# Altium schematic sheet Bluetooth.SchDoc
size A4; SheetNumber: 3
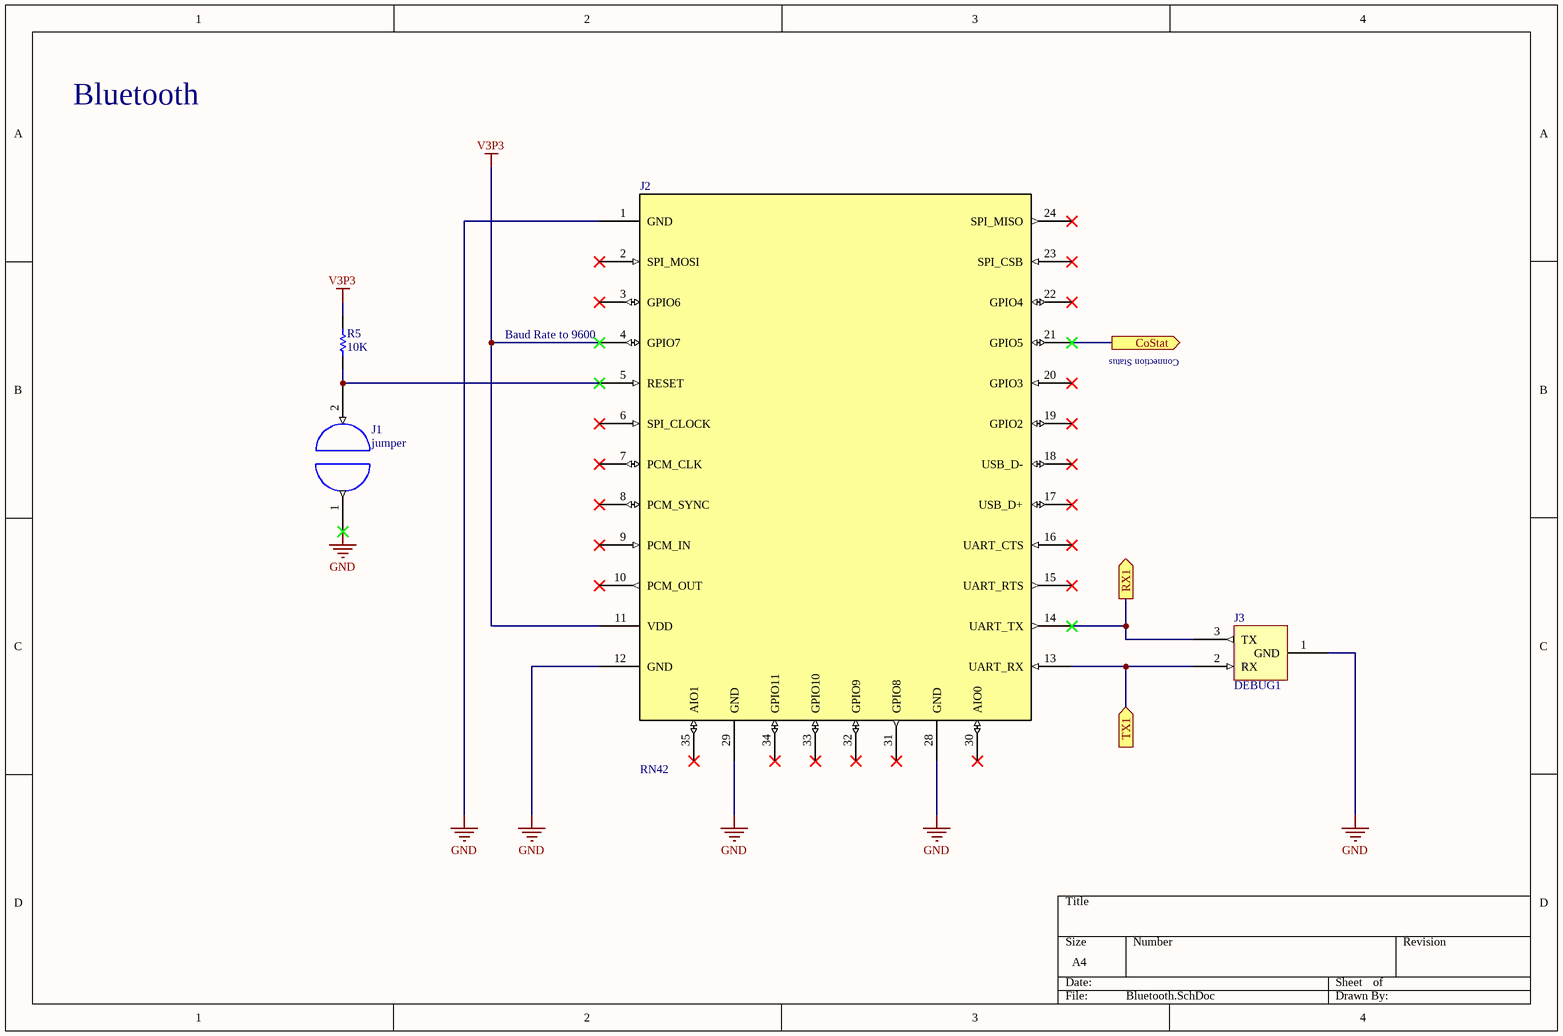
[diagram p0: Bluetooth.SchDoc]

## Parts
J1  jumper  [jumper 254]
J2  RN42  [RN42]
J3  DEBUG1  [DEBUG3]
R5  10K  [own_0603]

## Ports
CoStat (out), RX1 (out), TX1 (in)

## Nets
GND: J1.1 J2.1(GND) J2.12(GND) J2.28(GND) J2.29(GND) J3.1(GND)
V3P3: J2.4(GPIO7) J2.11(VDD) R5.2
CoStat: J2.21(GPIO5) ; port CoStat
RX1: J2.14(UART_TX) J3.3(TX) ; port RX1
TX1: J2.13(UART_RX) J3.2(RX) ; port TX1
NetJ1_2: J1.2 J2.5(RESET) R5.1

Not connected (* = marked no-connect by the designer): J2 2(SPI_MOSI)* 3(GPIO6)* 6(SPI_CLOCK)* 7(PCM_CLK)* 8(PCM_SYNC)* 9(PCM_IN)* 10(PCM_OUT)* 15(UART_RTS)* 16(UART_CTS)* 17(USB_D+)* 18(USB_D-)* 19(GPIO2)* 20(GPIO3)* 22(GPIO4)* 23(SPI_CSB)* 24(SPI_MISO)* 30(AIO0)* 31(GPIO8)* 32(GPIO9)* 33(GPIO10)* 34(GPIO11)* 35(AIO1)*

## Notes on the sheet
- Bluetooth
- (near J2) Baud Rate to 9600
- Connection Status

## Library data of the parts
J2 = RN42: Bluetooth Module; Fabricant: Microchip; RefFabricant: RN42-I/RM; Fournisseur: Farnell; RefFournisseur: 2143310
J3 = TTL_Debug_3: Debug interface
R5 = Res1: Resistor; Fournisseur: Farnell; Fabricant: PANASONIC ELECTRONIC COMPONENTS; RefFabricant: ERA3ARW103V; RefFournisseur: 1688472